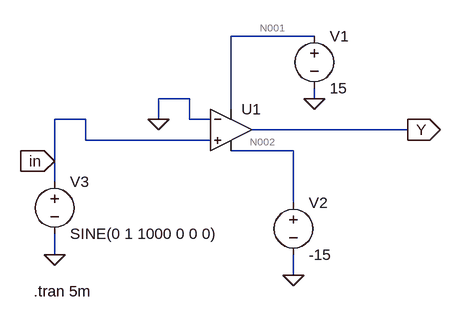
[diagram p0: schematic comparator.asc]
comparator.asc, the LTspice schematic file:
Version 4.1
SHEET 1 880 680
WIRE 416 64 288 64
WIRE 224 160 176 160
WIRE 416 160 416 144
WIRE 288 176 288 64
WIRE 64 192 16 192
WIRE 176 192 176 160
WIRE 224 192 224 160
WIRE 256 192 224 192
WIRE 560 208 320 208
WIRE 64 224 64 192
WIRE 256 224 64 224
WIRE 384 240 288 240
WIRE 16 256 16 192
WIRE 16 288 16 256
WIRE 384 320 384 240
WIRE 16 400 16 368
WIRE 384 432 384 400
FLAG 16 400 0
FLAG 416 160 0
FLAG 384 432 0
FLAG 560 208 Y
IOPIN 560 208 Out
FLAG 176 192 0
FLAG 16 256 in
IOPIN 16 256 In
SYMBOL OpAmps\\UniversalOpAmp2 288 208 R0
SYMATTR InstName U1
SYMBOL voltage 416 48 R0
WINDOW 123 0 0 Left 0
WINDOW 39 0 0 Left 0
SYMATTR InstName V1
SYMATTR Value 15
SYMBOL voltage 384 304 R0
WINDOW 123 0 0 Left 0
WINDOW 39 0 0 Left 0
SYMATTR InstName V2
SYMATTR Value -15
SYMBOL voltage 16 272 R0
WINDOW 123 0 0 Left 0
WINDOW 39 0 0 Left 0
SYMATTR InstName V3
SYMATTR Value SINE(0 1 1000 0 0 0)
TEXT -16 456 Left 2 !.tran 5m

The netlist it stands for:
* comparator.asc
X§U1 in 0 N001 N002 Y level2 Avol=1Meg GBW=10Meg Slew=10Meg Ilimit=25m Rail=0 Vos=0 En=0 Enk=0 In=0 Ink=0 Rin=500Meg  ; pins In+ In- V+ V- OUT
V1 N001 0 15
V2 N002 0 -15
V3 in 0 SINE(0 1 1000 0 0 0)
.tran 5m
.lib UniversalOpAmp2.lib
.backanno
.end

* Results of the author's LTspice run, read from the files saved beside the schematic
* Operating Point, zero values left out:
*   V(n001) = 15 V
*   V(n002) = -15 V
*   I(V1) = -1.498 mA
*   I(V2) = 1.498 mA
*   Ix(u1:3) = 1.498 mA
*   Ix(u1:4) = -1.498 mA
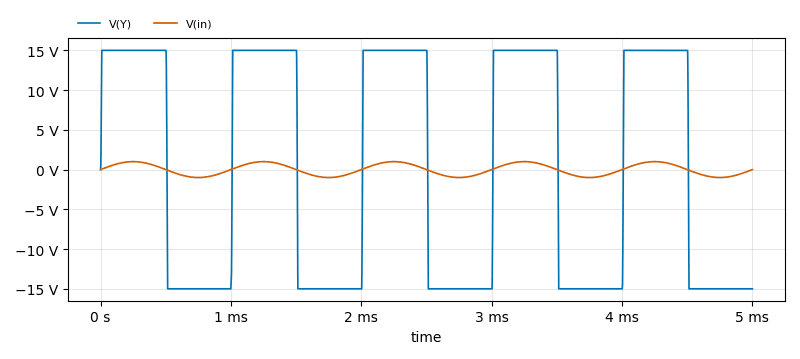
[diagram p1: Transient Analysis of comparator.asc, plotted from the saved traces]
* Transient Analysis, 1 run:
*   V(Y): min -15 V, max 15 V, average 38.35 mV, rms 14.91 V, last -15 V
*   V(in): min -1 V, max 1 V, average 0 V, rms 707.1 mV, last 0 V